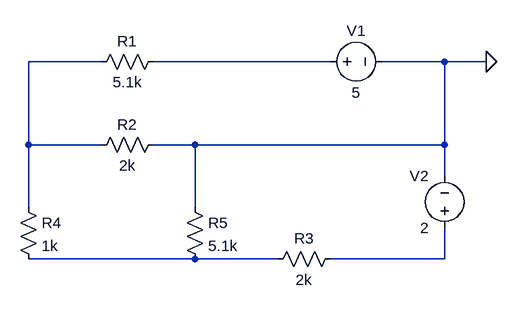
[diagram p0: schematic Lab3_1.asc]
Lab3_1.asc, the LTspice schematic file:
Version 4
SHEET 1 880 680
WIRE -224 64 -336 64
WIRE 128 64 -144 64
WIRE 304 64 208 64
WIRE 368 64 304 64
WIRE -336 192 -336 64
WIRE -224 192 -336 192
WIRE -80 192 -144 192
WIRE 304 192 304 64
WIRE 304 192 -80 192
WIRE 304 240 304 192
WIRE -336 288 -336 192
WIRE -80 288 -80 192
WIRE -80 368 -336 368
WIRE 48 368 -80 368
WIRE 304 368 304 320
WIRE 304 368 128 368
FLAG 368 64 0
SYMBOL voltage 304 336 R180
WINDOW 0 24 96 Left 2
WINDOW 3 24 16 Left 2
WINDOW 123 0 0 Left 0
WINDOW 39 0 0 Left 0
SYMATTR InstName V2
SYMATTR Value 2
SYMBOL voltage 112 64 R270
WINDOW 0 32 56 VTop 2
WINDOW 3 -32 56 VBottom 2
WINDOW 123 0 0 Left 0
WINDOW 39 0 0 Left 0
SYMATTR InstName V1
SYMATTR Value 5
SYMBOL res -128 48 R90
WINDOW 0 0 56 VBottom 2
WINDOW 3 32 56 VTop 2
SYMATTR InstName R1
SYMATTR Value 5.1k
SYMBOL res -128 176 R90
WINDOW 0 0 56 VBottom 2
WINDOW 3 32 56 VTop 2
SYMATTR InstName R2
SYMATTR Value 2k
SYMBOL res 144 352 R90
WINDOW 0 0 56 VBottom 2
WINDOW 3 32 56 VTop 2
SYMATTR InstName R3
SYMATTR Value 2k
SYMBOL res -352 272 R0
SYMATTR InstName R4
SYMATTR Value 1k
SYMBOL res -96 272 R0
SYMATTR InstName R5
SYMATTR Value 5.1k

The netlist it stands for:
* Lab3_1.asc
V2 N004 0 2
V1 N002 0 5
R1 N002 N001 5.1k
R2 0 N001 2k
R3 N004 N003 2k
R4 N001 N003 1k
R5 0 N003 5.1k
.backanno
.end